# Altium schematic sheet Battery Feed and Socket.SchDoc: System Battery Feed and Battery Socket
size A4; SheetNumber: 3; SheetTotal: 37
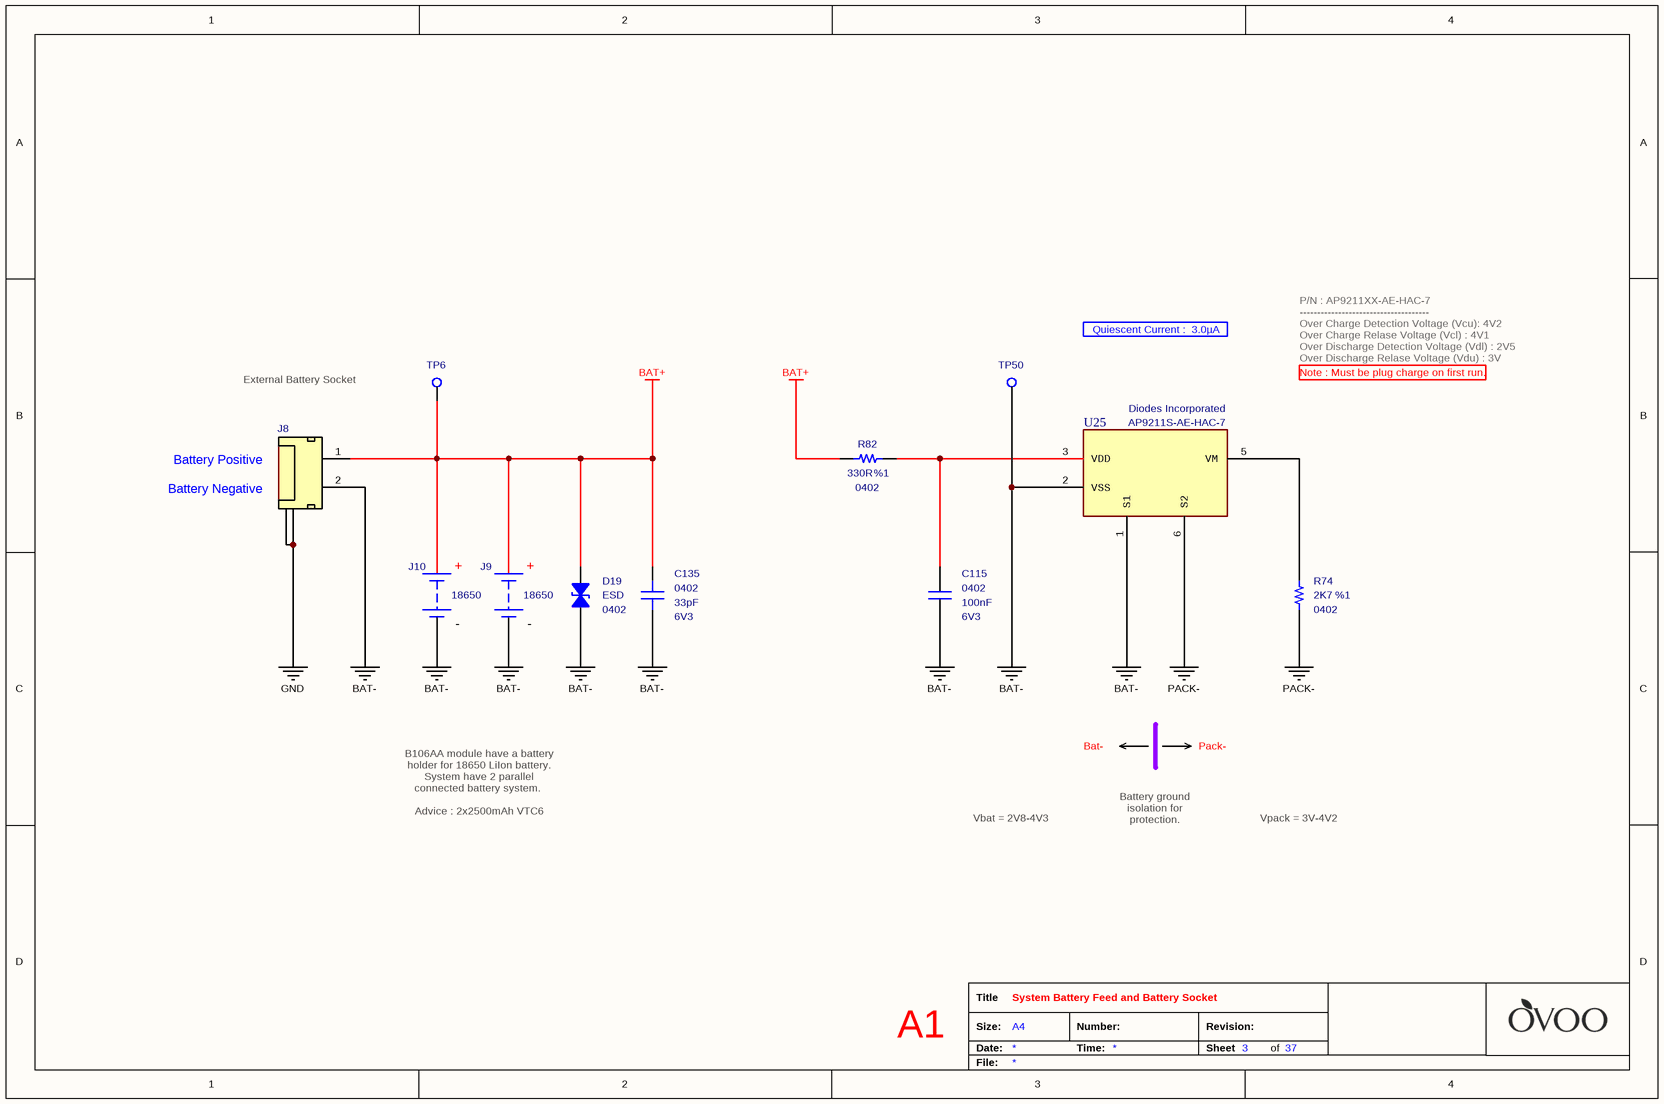
[diagram p0: Battery Feed and Socket.SchDoc]

## Parts
C115  value 100nF  Case: 0402  Voltage: 6V3  [CAPACITOR_0402]  (hidden comment: Multilayer Ceramic Capacitor)
C135  value 33pF  Case: 0402  Voltage: 6V3  [CAPACITOR_0402]  (hidden comment: Multilayer Ceramic Capacitor)
D19  Case: 0402  [ESD_0402]  (hidden comment: ESD Suppressors)
J8  External Battery Socket  [Connector_Tunic 2P - H]  (value not drawn)
J9  Battery Size: 18650  [BATTERY_HOLDER - Bat - NoSilk]  (hidden comment: Battery Clip Holder and Battery)
J10  Battery Size: 18650  [BATTERY_HOLDER - Bat - NoSilk]  (hidden comment: Battery Clip Holder and Battery)
R74  value 2K7  Case: 0402  Tolerance: %1  [RESISTOR_0402]  (hidden comment: Thick Film Resistor)
R82  value 330R  Tolerance: %1  Case: 0402  [RESISTOR_0402]  (hidden comment: Thick Film Resistor)
TP6  PCB - Test Point  [Test_Pad - Hole]  (value not drawn)  (no BOM)
TP50  PCB - Test Point  [Test_Pad - Hole]  (value not drawn)  (no BOM)
U25  Manufacturer_Part_Number: AP9211S-AE-HAC-7  Manufacturer_Name: Diodes Incorporated  [AP9211]  (hidden comment: Battery Management IC)

## Nets
BAT+: C135.2 D19.2 J8.1(BAT+) J9.1(BAT+) J10.1(BAT+) R82.2 TP6.1
BAT-: C115.2 C135.1 D19.1 J8.2(BAT-) J9.2(BAT-) J10.2(BAT-) TP50.1 U25.1(S1) U25.2(VSS)
GND: J8.3(Termination) J8.4(Termination)
PACK-: R74.1 U25.6(S2)
NetC115_1: C115.1 R82.1 U25.3(VDD)
NetR74_2: R74.2 U25.5(VM)

## Notes on the sheet
- Quiescent Current :  3.0µA
- External Battery Socket
- P/N : AP9211XX-AE-HAC-7
  -------------------------------------
  Over Charge Detection Voltage (Vcu): 4V2
  Over Charge Relase Voltage (Vcl) : 4V1
  Over Discharge Detection Voltage (Vdl) : 2V5
  Over Discharge Relase Voltage (Vdu) : 3V
- Note : Must be plug charge on first run.
- (near J8) Battery Positive
  Battery Negative
- Bat-
- Pack-
- B106AA module have a battery holder for 18650 LiIon battery. System have 2 parallel connected battery system.
  Advice : 2x2500mAh VTC6
- Vbat = 2V8-4V3
- Battery ground isolation for protection.
- Vpack = 3V-4V2
- A1
- Title
- Size:
- Date:
- A4
- Number:
- Time:
- Revision:
- Sheet
- of
- File:
- (in symbol Connector - Battery Clip Holder + Battery) +; -
- (in symbol Diode - ESD Protection) ESD

## Library data of the parts
C115 = Capacitor - 100nF [0402-6V3]: Capacitor - 100nF [0402-6V3] (Ceramic); Manufacturer_Name: AVX; Manufacturer_Part_Number: 04026D104KAT4A; Dielectric: X5R; Tolerance: %10; Height: 0.25mm; Mouser_Part_Number: 581-04026D104KAT4A; ComponentLink1Description: Mouser; ComponentLink1URL: https://www.mouser.com.tr/ProductDetail/AVX/04026D104KAT4A?qs=sGAEpiMZZMs0AnBnWHyRQPg4iYkCw7IMED%2F4kpqgf7w%3D; ComponentLink2Description: DataSheet; ComponentLink2URL: https://www.mouser.com.tr/datasheet/2/40/cx5r-776519.pdf; ROHS: Yes; Maximum Operating Temperature: +85; Minimum Operating Temperature: -55; Supplier 1: Avnet; Supplier Part Number 1: 04026D104KAT4A
C135 = Capacitor - 33pF [0402-6V3]: Capacitor - 33pF [0402] (Ceramic); Manufacturer_Name: Kemet; Manufacturer_Part_Number: C0402C330J9RACAUTO; Dielectric: X7R; Tolerance: 10%; Height: 0.5mm; Mouser_Part_Number: 80-C0402C330J9RAUTO; Maximum Operating Temperature: +125; Minimum Operating Temperature: -55; ROHS: Yes; ComponentLink1Description: DataSheet; ComponentLink1URL: https://api.kemet.com/component-edge/download/datasheet/C0402C330J9RACAUTO.pdf; ComponentLink2Description: Mouser; ComponentLink2URL: https://www.mouser.com/Search/Refine.aspx?Keyword=80-C0402C330J9RAUTO; Supplier 1: Mouser; Supplier Part Number 1: 80-C0402C330J9RAUTO
D19 = Diode - ESD Protection: TVS Diode (Bi-directional); Manufacturer_Part_Number: 0402ESDA-MLP1; Manufacturer_Name: Bussmann / Eaton; Clamping Voltage: 35V; Diode Capacitance: 0.05pF; Polarity: Bidirectional; Voltage ESD Air Gap: 15kV; Voltage ESD Contact: 8kV; Working Voltage: 30V; Height: 0.436mm; Mouser_Part_Number: 504-0402ESDA-MLP1; Maximum Operating Temperature: +125; Minimum Operating Temperature: -55; ROHS: Yes; ComponentLink1Description: DataSheet; ComponentLink1URL: https://www.mouser.com.tr/datasheet/2/87/47c59e11-d058-4882-bc35-d8572f2ca054-38826.pdf; ComponentLink2Description: Mouser; ComponentLink2URL: https://www.mouser.com.tr/ProductDetail/Bussmann-Eaton/0402ESDA-MLP1?qs=%2Fha2pyFadughxyc7TyLWeW%2FUvipVY6Ex3naV%2FjpO3plZBZWDLqV4bw%3D%3D; Supplier 1: Mouser; Supplier 2: Digi-Key; Supplier Part Number 2: 283-2964-1-ND; Supplier Part Number 1: 504-0402ESDA-MLP1
J8 = Connector - Mini Tunic 2P (1.25): Mini Tunic Connector with 2P; Manufacturer_Name: Molex; Manufacturer_Part_Number: 53261-0271; Height: 3.55mm; Mouser_Part_Number: 538-53261-0271; ROHS: Yes; Supplier 1: Mouser; Supplier 2: Digi-Key; Supplier Part Number 1: 538-53261-0271; Supplier Part Number 2: WM7620DKR-ND
J9 J10 = Connector - Battery Clip Holder + Battery: Cylindrical Battery Contacts, Clips, Holders & Springs 16MM - 19MM SM BATTERY CLIP; Manufacturer_Name: Keystone Electronics; Manufacturer_Part_Number: 254; ROHS: Yes; ComponentLink1Description: DataSheet; ComponentLink1URL: https://www.mouser.com.tr/datasheet/2/215/254-1662482.pdf; ComponentLink2Description: Mouser; ComponentLink2URL: https://www.mouser.com.tr/ProductDetail/Keystone-Electronics/254?qs=sGAEpiMZZMt13fpse6CWDeN7rxuhSMCmCb8dqu6gK9OS7H31eWULIQ==; Mouser_Part_Number: 534-254; Supplier 1: Mouser; Supplier Part Number 1: 534-550
R74 = Resistor - 2K7: Thick Film Resistors - SMD 1/16 W 2.7 Kohms 1%; Manufacturer_Name: Vishay; Manufacturer_Part_Number: CRCW04022K70FKED; Height: 0.35mm; Mouser_Part_Number: 71-CRCW0402-2.7K-E3; ComponentLink1Description: DataSheet; ComponentLink1URL: https://www.mouser.com.tr/datasheet/2/427/dcrcwe3-1762152.pdf; ComponentLink2Description: Mouser; ComponentLink2URL: https://www.mouser.com.tr/ProductDetail/Vishay-Dale/CRCW04022K70FKED?qs=sGAEpiMZZMu61qfTUdNhG7nHf%2F6MTUn3G4wz%252BGDNrew%3D; Supplier 1: Digi-Key; Supplier Part Number 1: 541-2.70KLCT-ND
R82 = Resistor - 330R: Thick Film Resistors - SMD 1/16 W 330 Ohm 1%; Manufacturer_Name: Vishay; Manufacturer_Part_Number: CRCW0402330RFKED; Height: 0.4mm; Mouser_Part_Number: 71-CRCW0402-330-E3; ComponentLink1Description: DataSheet; ComponentLink1URL: https://www.mouser.com.tr/datasheet/2/427/dcrcwe3-1762152.pdf; ComponentLink2Description: Mouser; ComponentLink2URL: https://www.mouser.com.tr/ProductDetail/Vishay-Dale/CRCW0402330RFKED?qs=sGAEpiMZZMu61qfTUdNhG2DpbjADlD3GGS6SwBlLi5Q%3D; Supplier 1: Mouser; Supplier 2: Digi-Key; Supplier Part Number 2: 541-330LCT-ND; Supplier Part Number 1: 71-CRCW0402-330-E3
TP6 TP50 = PCB - Test Point: Test Point
U25 = IC - AP9211: Battery Management SGL Chip Protection 12Vdss 12Vgss 1000mW; AECQ10x: No; Built-In Dual NMOS: Yes; Charge Overcurrent Detection Voltage VCOC: 0.2 to 0.05 V; Detection Delay: Built-In Delay Timer; Discharge Overcurrent Detection Voltage VDOC: 0.05 to 0.32 V; Function: Battery Protection; Load Short Detection Voltage VSHORT: 0.16 to 0.32 V; Overcharge Detection Voltage VCU: 3.5 to 4.5 V; Overdischarge Detection Voltage VDL: 2 to 3.4 V; Power-Down Function: Selectable; RSS(ON) @VGS=3.9V: 27 mΩ; RoHS: Yes; Mouser_Part_Number: 621-AP9211S-AE-HAC-7; Case: U-DFN2030-6; ComponentLink1Description: DataSheet; ComponentLink1URL: https://www.mouser.com.tr/datasheet/2/115/AP9211-838143.pdf; ComponentLink2Description: Mouser; ComponentLink2URL: https://www.mouser.com.tr/ProductDetail/Diodes-Incorporated/AP9211S-AE-HAC-7?qs=%2Fha2pyFaduhU8ORG8s%252BdQ0PvBZ%252Bj6P04h11i28rtWnQ%2FLO517Oqhtw%3D%3D; ComponentLink3Description: ProductPage; ComponentLink3URL: https://www.diodes.com/part/view/AP9211; Application: 1-Cell; Automotive Compliant PPAP: No; Supplier 1: Mouser; Supplier Part Number 1: 621-AP9211S-AE-HAC-7